# Altium schematic sheet 08_FPGA_banks_6_7_8.SchDoc: FPGA banks 6, 7, 8
size A3; Organization: Lime Microsystems; Address1: Surrey Tech Centre; Address2: Guildford GU2 7YG; Address3: Surrey; Address4: United Kingdom; Revision: SoDeRa-PCI v1.0; SheetNumber: 8; SheetTotal: 15
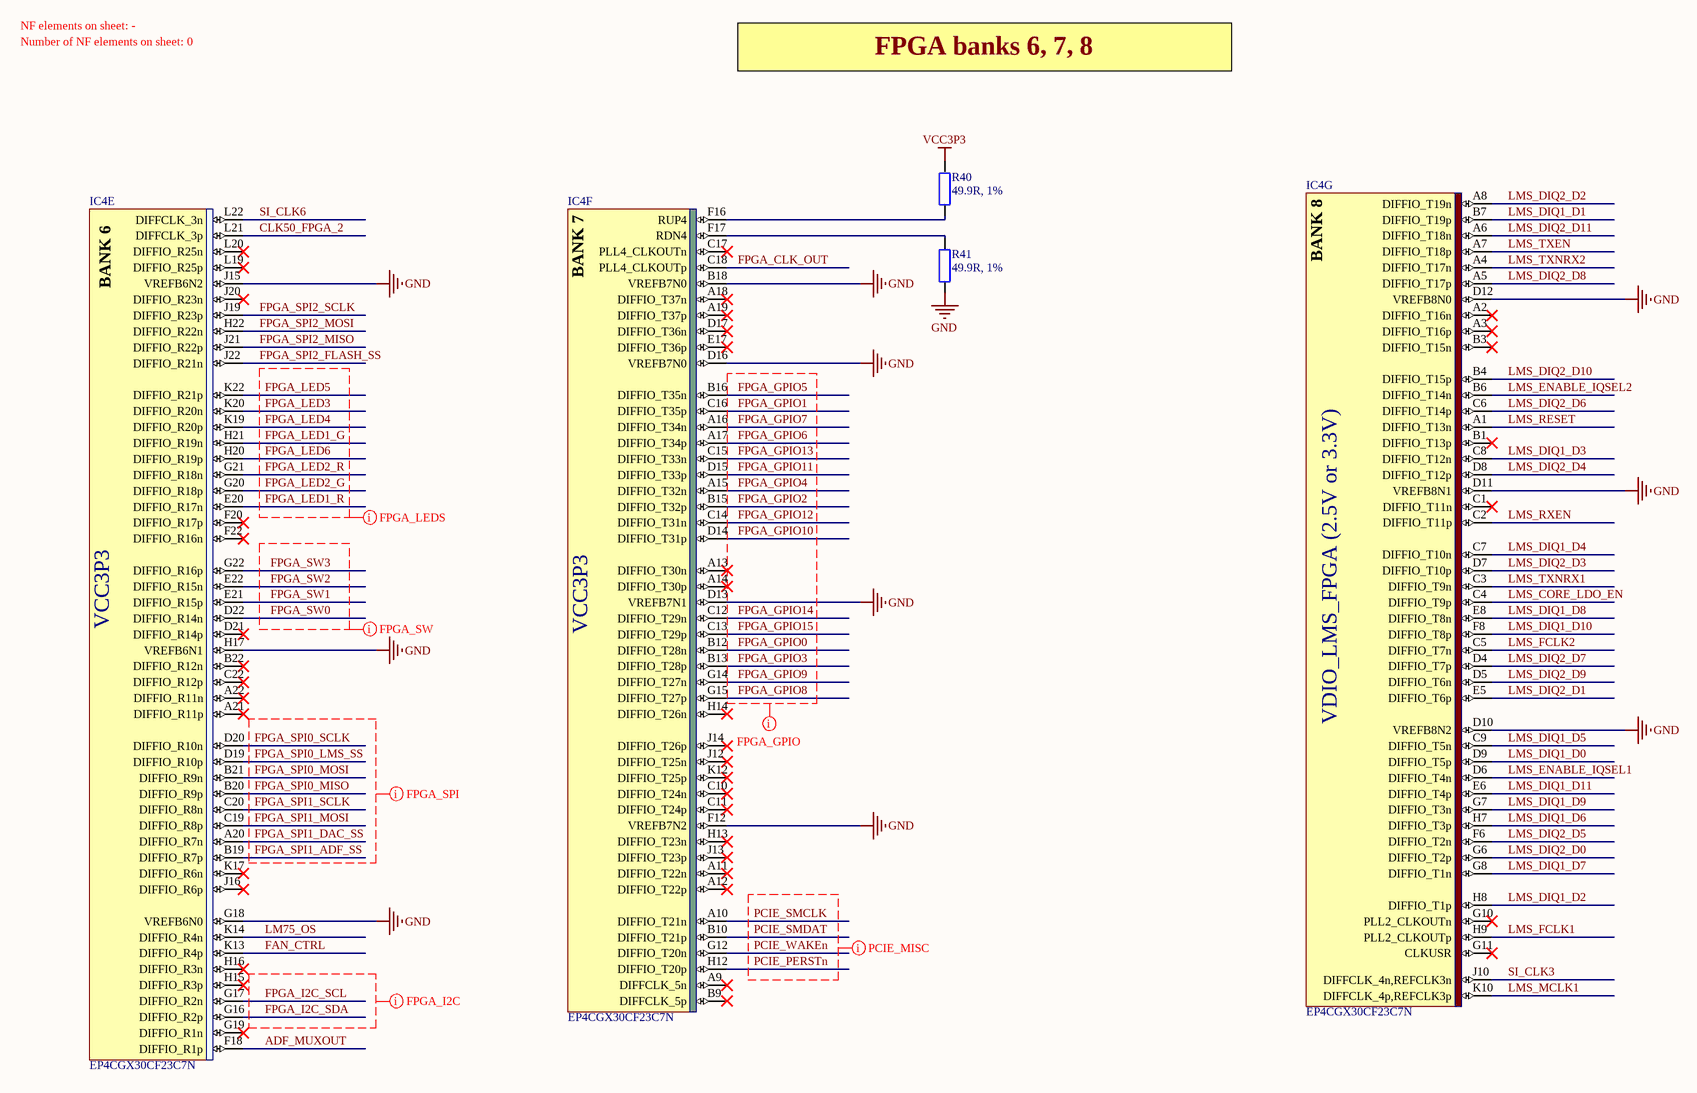
[diagram p0: 08_FPGA_banks_6_7_8.SchDoc]

## Parts
IC4  EP4CGX30CF23C7N  [ALTR-FBGA484_A-200]  (parts E,F,G of 10)
R40  49.9R, 1%  [RES0402]
R41  49.9R, 1%  [RES0402]

## Nets
GND: IC4.B18(VREFB7N0) IC4.D10(VREFB8N2) IC4.D11(VREFB8N1) IC4.D12(VREFB8N0) IC4.D13(VREFB7N1) IC4.D16(VREFB7N0) IC4.F12(VREFB7N2) IC4.G18(VREFB6N0) IC4.H17(VREFB6N1) IC4.J15(VREFB6N2) R41.1
VCC3P3: R40.2
ADF_MUXOUT: IC4.F18(DIFFIO_R1p)
CLK50_FPGA_2: IC4.L21(DIFFCLK_3p)
FAN_CTRL: IC4.K13(DIFFIO_R4p)
FPGA_CLK_OUT: IC4.C18(PLL4_CLKOUTp)
FPGA_GPIO0: IC4.B12(DIFFIO_T28n)
FPGA_GPIO1: IC4.C16(DIFFIO_T35p)
FPGA_GPIO2: IC4.B15(DIFFIO_T32p)
FPGA_GPIO3: IC4.B13(DIFFIO_T28p)
FPGA_GPIO4: IC4.A15(DIFFIO_T32n)
FPGA_GPIO5: IC4.B16(DIFFIO_T35n)
FPGA_GPIO6: IC4.A17(DIFFIO_T34p)
FPGA_GPIO7: IC4.A16(DIFFIO_T34n)
FPGA_GPIO8: IC4.G15(DIFFIO_T27p)
FPGA_GPIO9: IC4.G14(DIFFIO_T27n)
FPGA_GPIO10: IC4.D14(DIFFIO_T31p)
FPGA_GPIO11: IC4.D15(DIFFIO_T33p)
FPGA_GPIO12: IC4.C14(DIFFIO_T31n)
FPGA_GPIO13: IC4.C15(DIFFIO_T33n)
FPGA_GPIO14: IC4.C12(DIFFIO_T29n)
FPGA_GPIO15: IC4.C13(DIFFIO_T29p)
FPGA_I2C_SCL: IC4.G17(DIFFIO_R2n)
FPGA_I2C_SDA: IC4.G16(DIFFIO_R2p)
FPGA_LED1_G: IC4.H21(DIFFIO_R19n)
FPGA_LED1_R: IC4.E20(DIFFIO_R17n)
FPGA_LED2_G: IC4.G20(DIFFIO_R18p)
FPGA_LED2_R: IC4.G21(DIFFIO_R18n)
FPGA_LED3: IC4.K20(DIFFIO_R20n)
FPGA_LED4: IC4.K19(DIFFIO_R20p)
FPGA_LED5: IC4.K22(DIFFIO_R21p)
FPGA_LED6: IC4.H20(DIFFIO_R19p)
FPGA_SPI0_LMS_SS: IC4.D19(DIFFIO_R10p)
FPGA_SPI0_MISO: IC4.B20(DIFFIO_R9p)
FPGA_SPI0_MOSI: IC4.B21(DIFFIO_R9n)
FPGA_SPI0_SCLK: IC4.D20(DIFFIO_R10n)
FPGA_SPI1_ADF_SS: IC4.B19(DIFFIO_R7p)
FPGA_SPI1_DAC_SS: IC4.A20(DIFFIO_R7n)
FPGA_SPI1_MOSI: IC4.C19(DIFFIO_R8p)
FPGA_SPI1_SCLK: IC4.C20(DIFFIO_R8n)
FPGA_SPI2_FLASH_SS: IC4.J22(DIFFIO_R21n)
FPGA_SPI2_MISO: IC4.J21(DIFFIO_R22p)
FPGA_SPI2_MOSI: IC4.H22(DIFFIO_R22n)
FPGA_SPI2_SCLK: IC4.J19(DIFFIO_R23p)
FPGA_SW0: IC4.D22(DIFFIO_R14n)
FPGA_SW1: IC4.E21(DIFFIO_R15p)
FPGA_SW2: IC4.E22(DIFFIO_R15n)
FPGA_SW3: IC4.G22(DIFFIO_R16p)
LM75_OS: IC4.K14(DIFFIO_R4n)
LMS_CORE_LDO_EN: IC4.C4(DIFFIO_T9p)
LMS_DIQ1_D0: IC4.D9(DIFFIO_T5p)
LMS_DIQ1_D1: IC4.B7(DIFFIO_T19p)
LMS_DIQ1_D2: IC4.H8(DIFFIO_T1p)
LMS_DIQ1_D3: IC4.C8(DIFFIO_T12n)
LMS_DIQ1_D4: IC4.C7(DIFFIO_T10n)
LMS_DIQ1_D5: IC4.C9(DIFFIO_T5n)
LMS_DIQ1_D6: IC4.H7(DIFFIO_T3p)
LMS_DIQ1_D7: IC4.G8(DIFFIO_T1n)
LMS_DIQ1_D8: IC4.E8(DIFFIO_T8n)
LMS_DIQ1_D9: IC4.G7(DIFFIO_T3n)
LMS_DIQ1_D10: IC4.F8(DIFFIO_T8p)
LMS_DIQ1_D11: IC4.E6(DIFFIO_T4p)
LMS_DIQ2_D0: IC4.G6(DIFFIO_T2p)
LMS_DIQ2_D1: IC4.E5(DIFFIO_T6p)
LMS_DIQ2_D2: IC4.A8(DIFFIO_T19n)
LMS_DIQ2_D3: IC4.D7(DIFFIO_T10p)
LMS_DIQ2_D4: IC4.D8(DIFFIO_T12p)
LMS_DIQ2_D5: IC4.F6(DIFFIO_T2n)
LMS_DIQ2_D6: IC4.C6(DIFFIO_T14p)
LMS_DIQ2_D7: IC4.D4(DIFFIO_T7p)
LMS_DIQ2_D8: IC4.A5(DIFFIO_T17p)
LMS_DIQ2_D9: IC4.D5(DIFFIO_T6n)
LMS_DIQ2_D10: IC4.B4(DIFFIO_T15p)
LMS_DIQ2_D11: IC4.A6(DIFFIO_T18n)
LMS_ENABLE_IQSEL1: IC4.D6(DIFFIO_T4n)
LMS_ENABLE_IQSEL2: IC4.B6(DIFFIO_T14n)
LMS_FCLK1: IC4.H9(PLL2_CLKOUTp)
LMS_FCLK2: IC4.C5(DIFFIO_T7n)
LMS_MCLK1: IC4.K10(DIFFCLK_4p,REFCLK3p)
LMS_RESET: IC4.A1(DIFFIO_T13n)
LMS_RXEN: IC4.C2(DIFFIO_T11p)
LMS_TXEN: IC4.A7(DIFFIO_T18p)
LMS_TXNRX1: IC4.C3(DIFFIO_T9n)
LMS_TXNRX2: IC4.A4(DIFFIO_T17n)
PCIE_PERSTn: IC4.H12(DIFFIO_T20p)
PCIE_SMCLK: IC4.A10(DIFFIO_T21n)
PCIE_SMDAT: IC4.B10(DIFFIO_T21p)
PCIE_WAKEn: IC4.G12(DIFFIO_T20n)
SI_CLK3: IC4.J10(DIFFCLK_4n,REFCLK3n)
SI_CLK6: IC4.L22(DIFFCLK_3n)
NetIC4_F16: IC4.F16(RUP4) R40.1
NetIC4_F17: IC4.F17(RDN4) R41.2

Not connected (* = marked no-connect by the designer): IC4 A2(DIFFIO_T16n)* A3(DIFFIO_T16p)* A9(DIFFCLK_5n)* A11(DIFFIO_T22n)* A12(DIFFIO_T22p)* A13(DIFFIO_T30n)* A14(DIFFIO_T30p)* A18(DIFFIO_T37n)* A19(DIFFIO_T37p)* A21(DIFFIO_R11p)* A22(DIFFIO_R11n)* B1(DIFFIO_T13p)* B3(DIFFIO_T15n)* B9(DIFFCLK_5p)* B22(DIFFIO_R12n)* C1(DIFFIO_T11n)* C10(DIFFIO_T24n)* C11(DIFFIO_T24p)* C17(PLL4_CLKOUTn)* C22(DIFFIO_R12p)* D17(DIFFIO_T36n)* D21(DIFFIO_R14p)* E17(DIFFIO_T36p)* F20(DIFFIO_R17p)* F22(DIFFIO_R16n)* G10(PLL2_CLKOUTn)* G11(CLKUSR)* G19(DIFFIO_R1n)* H13(DIFFIO_T23n)* H14(DIFFIO_T26n)* H15(DIFFIO_R3p)* H16(DIFFIO_R3n)* J12(DIFFIO_T25n)* J13(DIFFIO_T23p)* J14(DIFFIO_T26p)* J16(DIFFIO_R6p)* J20(DIFFIO_R23n)* K12(DIFFIO_T25p)* K17(DIFFIO_R6n)* L19(DIFFIO_R25p)* L20(DIFFIO_R25n)*

## Layout directives
net class FPGA_GPIO: FPGA_GPIO0, FPGA_GPIO1, FPGA_GPIO2, FPGA_GPIO3, FPGA_GPIO4, FPGA_GPIO5, FPGA_GPIO6, FPGA_GPIO7, FPGA_GPIO8, FPGA_GPIO9, FPGA_GPIO10, FPGA_GPIO11, FPGA_GPIO12, FPGA_GPIO13, FPGA_GPIO14, FPGA_GPIO15
net class FPGA_LEDS: FPGA_LED1_G, FPGA_LED1_R, FPGA_LED2_G, FPGA_LED2_R, FPGA_LED3, FPGA_LED4, FPGA_LED5, FPGA_LED6
net class FPGA_SW: FPGA_SW0, FPGA_SW1, FPGA_SW2, FPGA_SW3
net class PCIE_MISC: PCIE_PERSTn, PCIE_SMCLK, PCIE_SMDAT, PCIE_WAKEn
net class FPGA_SPI: FPGA_SPI0_LMS_SS, FPGA_SPI0_MISO, FPGA_SPI0_MOSI, FPGA_SPI0_SCLK, FPGA_SPI1_ADF_SS, FPGA_SPI1_DAC_SS, FPGA_SPI1_MOSI, FPGA_SPI1_SCLK
net class FPGA_I2C: FPGA_I2C_SCL, FPGA_I2C_SDA

## Notes on the sheet
- NF elements on sheet: -
- Number of NF elements on sheet: 0
- FPGA banks 6, 7, 8
- VCC3P3
- VDIO_LMS_FPGA (2.5V or 3.3V)
- Title
- Size:
- Date:
- A3
- Revision:
- Time:
- Sheet
- of
- File:
- (in symbol EP4CGX30CF23C7N, part E) BANK 6
- (in symbol EP4CGX30CF23C7N, part F) BANK 7
- (in symbol EP4CGX30CF23C7N, part G) BANK 8

## Library data of the parts
IC4 = EP4CGX30CF23C7N: Manufacturer: Altera; Voltage - Supply: 1.16 V ~ 1.24 V; Number of I/O: 290; Total RAM Bits: 1105920; Number of Logic Elements/Cells: 29440; Number of LABs/CLBs: 1840; Supplier 1: Digi-Key; Package / Case: 484-BGA; Operating Temperature: 0°C ~ 85°C; Mounting Type: Surface Mount; Number of Gates: -; Supplier Device Package: 484-FBGA (23x23); Category: Integrated Circuits (ICs); RoHS: RoHS Compliant; Supplier Part Number 1: 544-2730-ND; Manufacturer Part Number 1: EP4CGX30CF23C7N
R40 R41 = Res_0402: Manufacturer: Samsung Electro-Mechanics America, Inc.; Manufacturer Part Number: RC1005F49R9CS; Temperature Coefficient: ±100ppm/°C; Resistance (Ohms): 49.9; Power (Watts): 0.063W, 1/16W; Number of Terminations: 2; Size / Dimension: 0.039" L x 0.020" W (1.00mm x 0.50mm); Supplier Device Package: 0402 (1005 Metric); RoHS: RoHS Compliant; Supplier Part Number 1: 1276-3469-6-ND; Features: -; Packaging: Digi-Reel®; Tolerance: ±1%; Height: 0.016" (0.40mm); Category: Resistors; Composition: Thick Film; Package / Case: 0402 (1005 Metric); Supplier 1: Digi-Key; Operating Temperature: -55°C ~ 155°C; Value: 49.9R, 1%